# Altium schematic sheet BreakawayUSB.SchDoc
size A
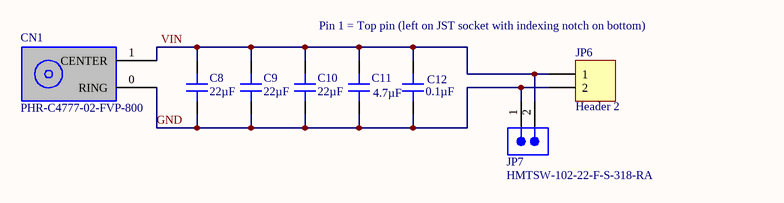
[diagram p0: BreakawayUSB.SchDoc]

## Parts
C8  22µF  [CAP 1206_3216 - 1.0MM]
C9  22µF  [CAP 1206_3216 - 1.0MM]
C10  22µF  [CAP 1206_3216 - 1.0MM]
C11  4.7µF  [CAP 1210_3225 - 2.8MM]
C12  0.1µF  [CAP 0603_1608]
CN1  PHR-C4777-02-FVP-800  [PHR-C4777-02-FVP-800]
JP6  Header 2  [HDR1X2]
JP7  HMTSW-102-22-F-S-318-RA  [SMTC-HMTSW-102-22-X-S-318-RA]

## Nets
GND: C8.2 C9.2 C10.2 C11.1 C12.1 CN1.0(RING) JP6.2 JP7.1
VIN: C8.1 C9.1 C10.1 C11.2 C12.2 CN1.1(CENTER) JP6.1 JP7.2

## Notes on the sheet
- Pin 1 = Top pin (left on JST socket with indexing notch on bottom)

## Library data of the parts
C8-C10 = LMK316BJ226MD-T: CAP CER 22UF 10V X5R 1206; Manufacturer: Taiyo Yuden; Tolerance: ±20%; Part Number: LMK316BJ226MD-T; Value: 22µF; Applications: General Purpose; Capacitance: 22µF; ComponentLink1Description: Datasheet; ComponentLink1URL: https://www.yuden.co.jp/productdata/catalog/mlcc01_e.pdf; ComponentLink2Description: DigiKey Link; ComponentLink2URL: http://digikey.com/product-detail/en/taiyo-yuden/LMK316BJ226MD-T/587-2233-1-ND/2002931; Device Package: 1206 (3216 Metric); LastUpdated: 1/21/2020 12:03:23 AM; Lifecycle Status: Active; Minimum Order: 1; Mounting Type: Surface Mount, MLCC; Operating Temperature: -55°C ~ 85°C; Package / Case: 1206 (3216 Metric); Packaging: TapeAndReel; PartId: 18964; Part Status: Active; Price: 0.16; Series: M; Size / Dimension: 0.126" L x 0.063" W (3.20mm x 1.60mm); Supplier 1: DigiKey; Supplier Part Number 1: 587-2233-1-ND; Temperature Coefficient: X5R; Thickness (Max): 0.037" (0.95mm); Voltage - Rated: 10V
C11 = UMK325B7475KM-T: CAP CER 4.7UF 50V X7R 1210; Manufacturer: Taiyo Yuden; Tolerance: ±10%; Part Number: UMK325B7475KM-T; Value: 4.7µF; Applications: General Purpose; Capacitance: 4.7µF; ComponentLink1Description: Datasheet; ComponentLink1URL: https://www.yuden.co.jp/productdata/catalog/mlcc01_e.pdf; ComponentLink2Description: DigiKey Link; ComponentLink2URL: http://digikey.com/product-detail/en/taiyo-yuden/UMK325B7475KM-T/587-2673-1-ND/2417260; Device Package: 1210 (3225 Metric); LastUpdated: 1/21/2020 12:30:50 AM; Lifecycle Status: Active; Minimum Order: 1; Mounting Type: Surface Mount, MLCC; Operating Temperature: -55°C ~ 125°C; Package / Case: 1210 (3225 Metric); Packaging: TapeAndReel; PartId: 23636; Part Status: Active; Price: 0.16; Series: M; Size / Dimension: 0.126" L x 0.098" W (3.20mm x 2.50mm); Supplier 1: DigiKey; Supplier Part Number 1: 587-2673-1-ND; Temperature Coefficient: X7R; Thickness (Max): 0.106" (2.70mm); Voltage - Rated: 50V
C12 = C0603C104K5RAC7411: CAP CER 0.1UF 50V X7R 0603; Manufacturer: KEMET; Tolerance: ±10%; Part Number: C0603C104K5RAC7411; Value: 0.1µF; Applications: Bypass, Decoupling; Capacitance: 0.1µF; ComponentLink1Description: Datasheet; ComponentLink1URL: https://api.kemet.com/component-edge/download/datasheet/C0603C104K5RAC7411.pdf; ComponentLink2Description: DigiKey Link; ComponentLink2URL: http://digikey.com/product-detail/en/kemet/C0603C104K5RAC7411/399-7374-2-ND/3317013; Device Package: 0603 (1608 Metric); LastUpdated: 1/21/2020 12:02:09 AM; Lifecycle Status: Active; Minimum Order: 15000; Mounting Type: Surface Mount, MLCC; Operating Temperature: -55°C ~ 125°C; Package / Case: 0603 (1608 Metric); Packaging: TapeAndReel; PartId: 2233; Part Status: Active; Price: 0.02; Series: SMD Comm X7R; Size / Dimension: 0.063" L x 0.031" W (1.60mm x 0.80mm); Supplier 1: DigiKey; Supplier Part Number 1: 399-7374-2-ND; Temperature Coefficient: X7R; Thickness (Max): 0.035" (0.90mm); Voltage - Rated: 50V
CN1 = PHR-C4777-02-FVP-800: Magnetic circular connector
JP6 = Header 2: Header, 2-Pin; LatestRevisionDate: 17-Jul-2002; LatestRevisionNote: Re-released for DXP Platform.; Publisher: Altium Limited
JP7 = HMTSW-102-22-F-S-318-RA: Modified .025" SQ Post Header, Through-hole, Right Angle, -55 to 125 degC, 2.54 mm Pitch, 2-Pin, Male, RoHS; Manufacturer: Samtec; Pitch: 2.54 mm; DatasheetVersion: F-214; PackageVersion: AL, 3/1987; PackageReference: HMTSW-102-22-X-S-318-RA; PackageDescription: Assembly .025 [.64] SQ. Post Hi-Temp Terminal Strip; Orientation: Right Angle; RoHS: True; Temperature Range: -55 to 125 degC; Mounting Technology: Through-hole; PartNumber: HMTSW-102-22-F-S-318-RA; ComponentLink1Description: Manufacturer URL; ComponentLink1URL: http://www.samtec.com; ComponentLink2Description: Datasheet; ComponentLink2URL: http://www.samtec.com/documents/webfiles/pdf/HMTSW.PDF; ComponentLink3Description: Package Specification; ComponentLink3URL: http://www.samtec.com/documents/webfiles/cpdf/HMTSW-XXX-XX-X-X-XXXX-XX-XX-MKT1.pdf